# Altium schematic sheet Top_Level.SchDoc: = Title
size 431 x 279 mm; Revision: v1.0; SheetNumber: 1; SheetTotal: 7
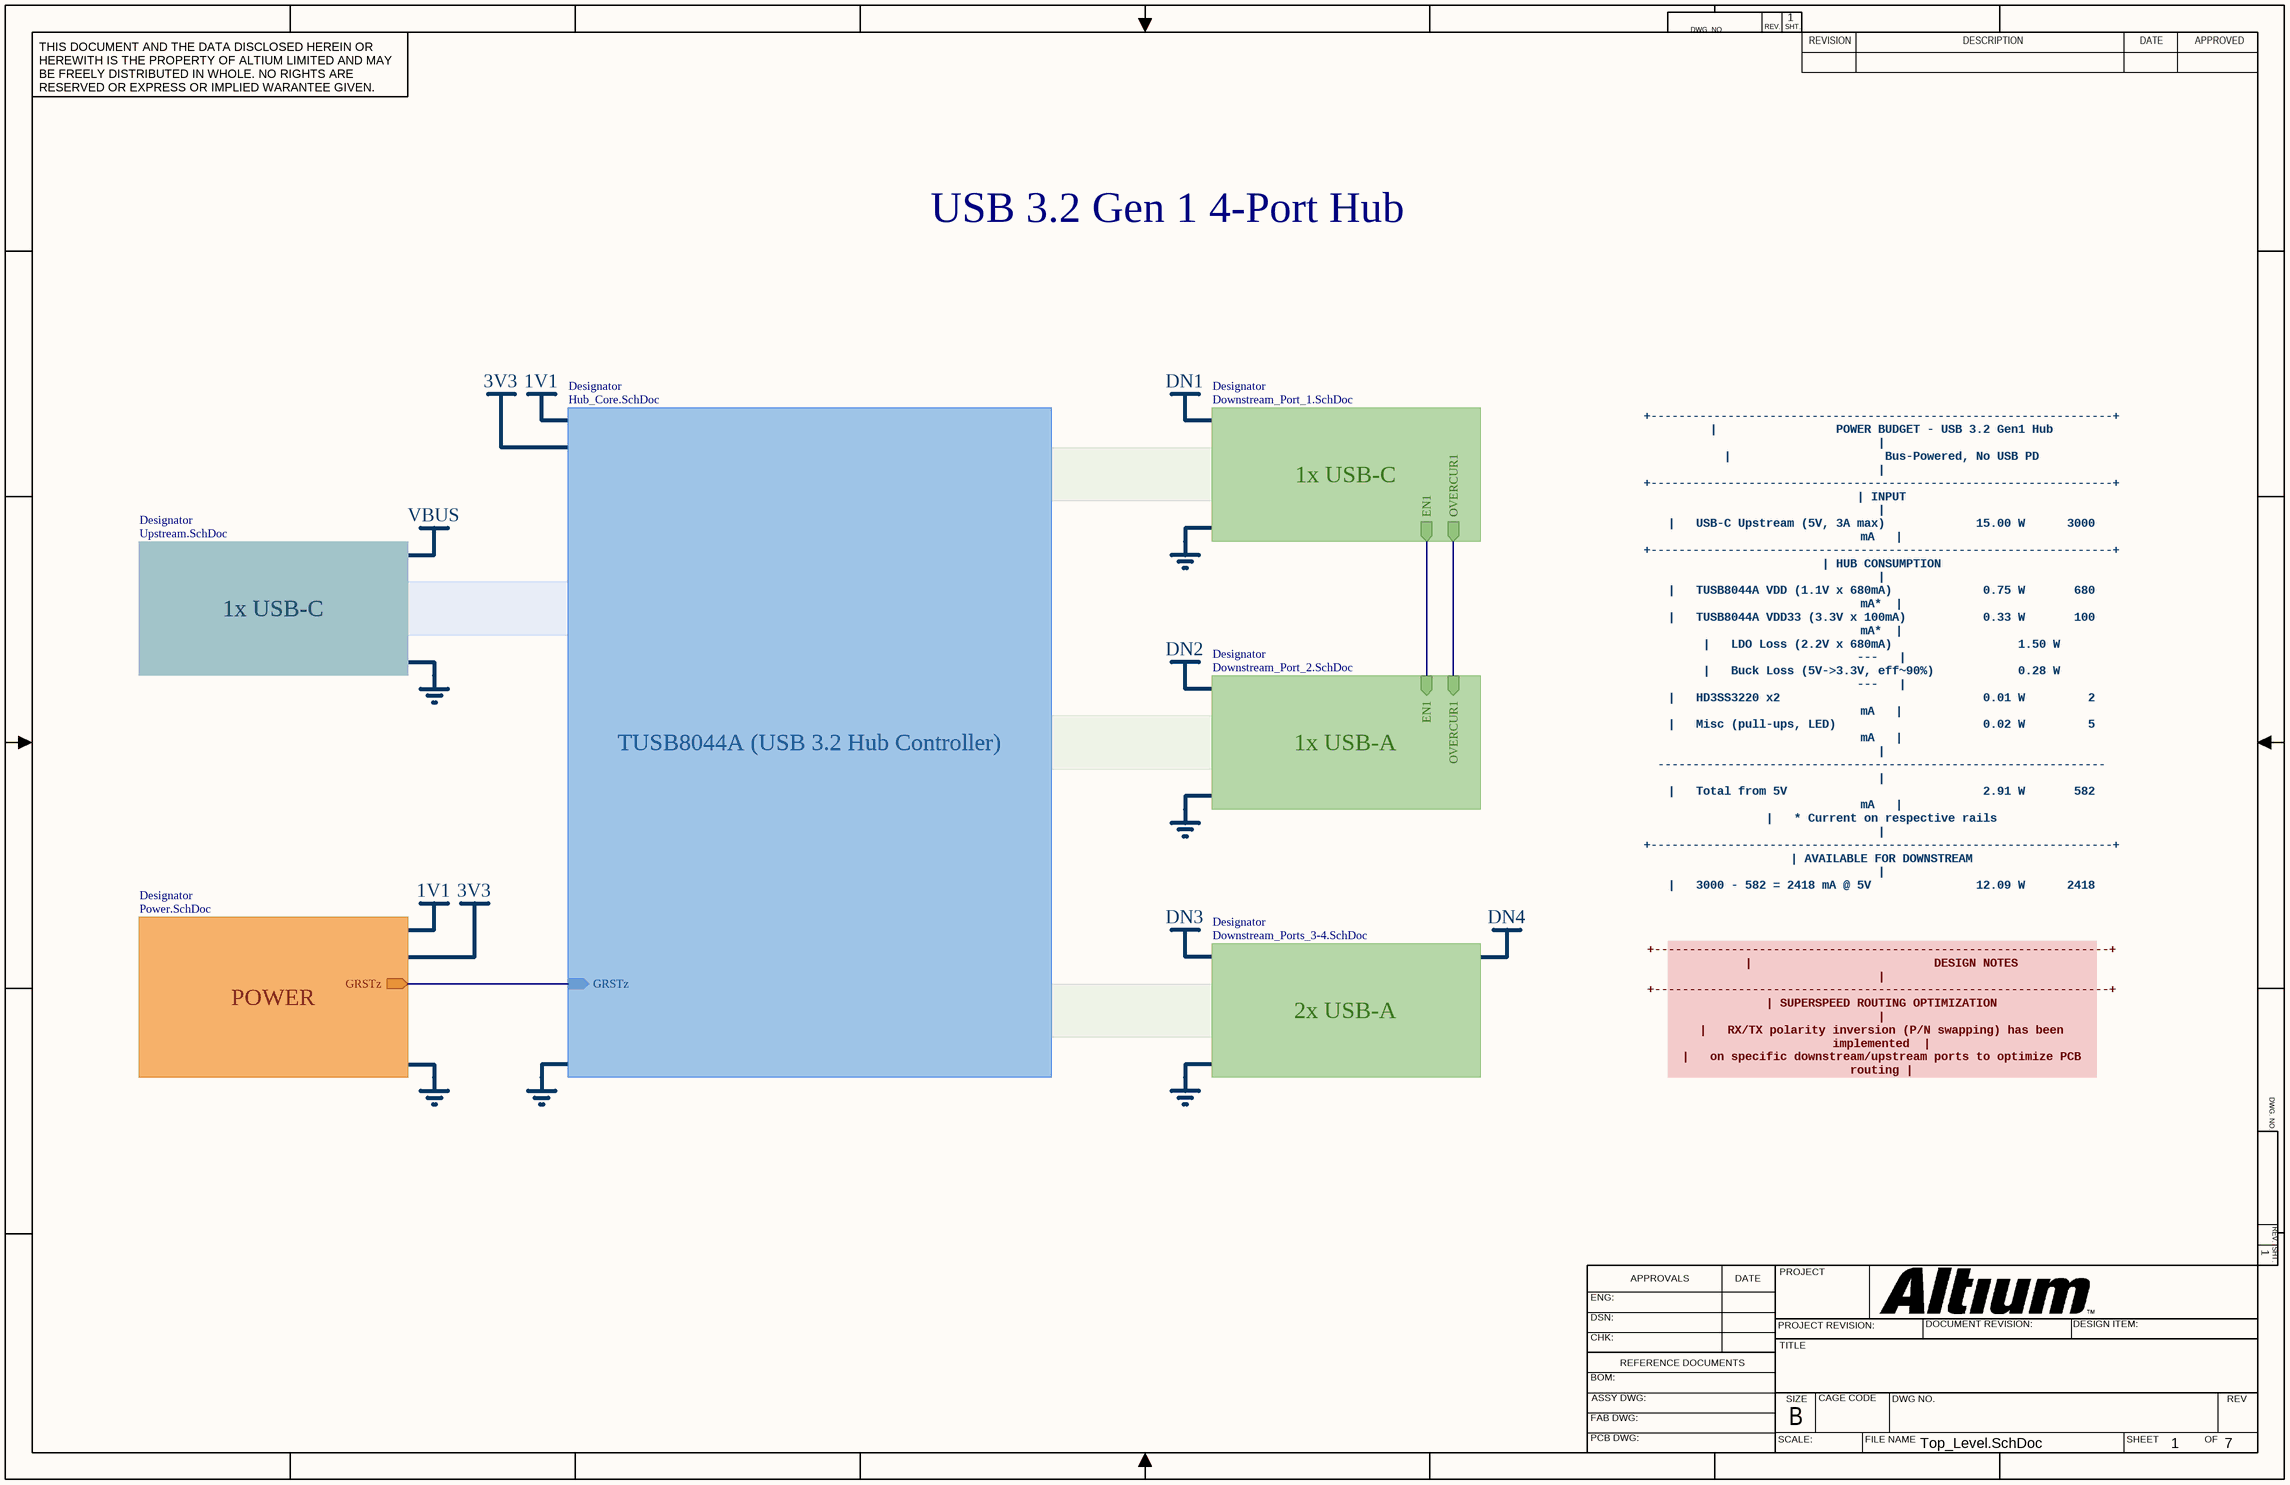
[diagram p0: Top_Level.SchDoc]

## Sub-sheets
Designator = Upstream.SchDoc: no entries
Designator = Power.SchDoc: GRSTz (out)
Designator = Hub_Core.SchDoc: GRSTz (in)
Designator = Downstream_Port_1.SchDoc: EN1 (out), OVERCUR1 (out)
Designator = Downstream_Ports_3-4.SchDoc: no entries
Designator = Downstream_Port_2.SchDoc: OVERCUR1 (in), EN1 (in)

## Nets
(unnamed): sheet Designator/GRSTz, sheet Designator/GRSTz
(unnamed): sheet Designator/EN1, sheet Designator/EN1
(unnamed): sheet Designator/OVERCUR1, sheet Designator/OVERCUR1

## Notes on the sheet
- USB 3.2 Gen 1 4-Port Hub
- 3V3
- 1V1
- DN1
- 1x USB-C
- VBUS
- DN2
- TUSB8044A (USB 3.2 Hub Controller)
- 1x USB-A
- +------------------------------------------------------------------+
  |                 POWER BUDGET - USB 3.2 Gen1 Hub                  |
  |                      Bus-Powered, No USB PD                      |
  +------------------------------------------------------------------+
  | INPUT                                                            |
  |   USB-C Upstream (5V, 3A max)             15.00 W      3000 mA   |
  +------------------------------------------------------------------+
  | HUB CONSUMPTION                                                  |
  |   TUSB8044A VDD (1.1V x 680mA)             0.75 W       680 mA*  |
  |   TUSB8044A VDD33 (3.3V x 100mA)           0.33 W       100 mA*  |
  |   LDO Loss (2.2V x 680mA)                  1.50 W          ---   |
  |   Buck Loss (5V->3.3V, eff~90%)            0.28 W          ---   |
  |   HD3SS3220 x2                             0.01 W         2 mA   |
  |   Misc (pull-ups, LED)                     0.02 W         5 mA   |
  | ---------------------------------------------------------------- |
  |   Total from 5V                            2.91 W       582 mA   |
  |   * Current on respective rails                                  |
  +------------------------------------------------------------------+
  | AVAILABLE FOR DOWNSTREAM                                         |
  |   3000 - 582 = 2418 mA @ 5V               12.09 W      2418 mA   |
  +------------------------------------------------------------------+
  | PORT CURRENT LIMITS (Per Channel)                                |
  |   P1 USB-C (TPS2561#1)   R_ILIM=37.4k                1.5 A max   |
  |   P2 USB-A (TPS2561#1)   R_ILIM=37.4k                1.5 A max   |
  |   P3 USB-A (TPS2561#2)   R_ILIM=56.0k                1.0 A max   |
  |   P4 USB-A (TPS2561#2)   R_ILIM=56.0k                1.0 A max   |
  | ---------------------------------------------------------------- |
  |   Worst case all ports:                  5.0 A  [EXCEEDS BUDGET] |
  |   Typical 2 ports:                      ~1.0 A  [WITHIN BUDGET]  |
  +------------------------------------------------------------------+
  | NOTES                                                            |
  |   - Worst case exceeds 3A upstream. PC Host overcurrent          |
  |     protection will limit total draw.                            |
  |   - BC 1.2 CDP: 1.5A/port while data active.                     |
  |   - BC 1.2 DCP: 1.5A/port, upstream absent.                      |
  +------------------------------------------------------------------+
- DN3
- DN4
- POWER
- 2x USB-A
- +-----------------------------------------------------------------+
  |                          DESIGN NOTES                           |
  +-----------------------------------------------------------------+
  | SUPERSPEED ROUTING OPTIMIZATION                                 |
  |   RX/TX polarity inversion (P/N swapping) has been implemented  |
  |   on specific downstream/upstream ports to optimize PCB routing |
  |   and preserve Signal Integrity. This is fully compliant with   |
  |   the USB 3.2 Gen 1 specification, which mandates automatic     |
  |   polarity inversion detection at the receiver.                 |
  +-----------------------------------------------------------------+
- DWG. NO.
- REV.
- SHT.
- THIS DOCUMENT AND THE DATA DISCLOSED HEREIN OR HEREWITH IS THE PROPERTY OF ALTIUM LIMITED AND MAY BE FREELY DISTRIBUTED IN WHOLE. NO RIGHTS ARE RESERVED OR EXPRESS OR IMPLIED WARANTEE GIVEN.
- REVISION
- DESCRIPTION
- DATE
- APPROVED
- ENG:
- APPROVALS
- PROJECT
- DSN:
- CHK:
- REFERENCE DOCUMENTS
- PROJECT REVISION:
- TITLE
- DOCUMENT REVISION:
- DESIGN ITEM:
- BOM:
- FAB DWG:
- PCB DWG:
- ASSY DWG:
- SCALE:
- SIZE
- B
- CAGE CODE
- FILE NAME
- DWG NO.
- SHEET
- OF
- REV